# EAGLE design DCAmp (EAGLE 5.11)
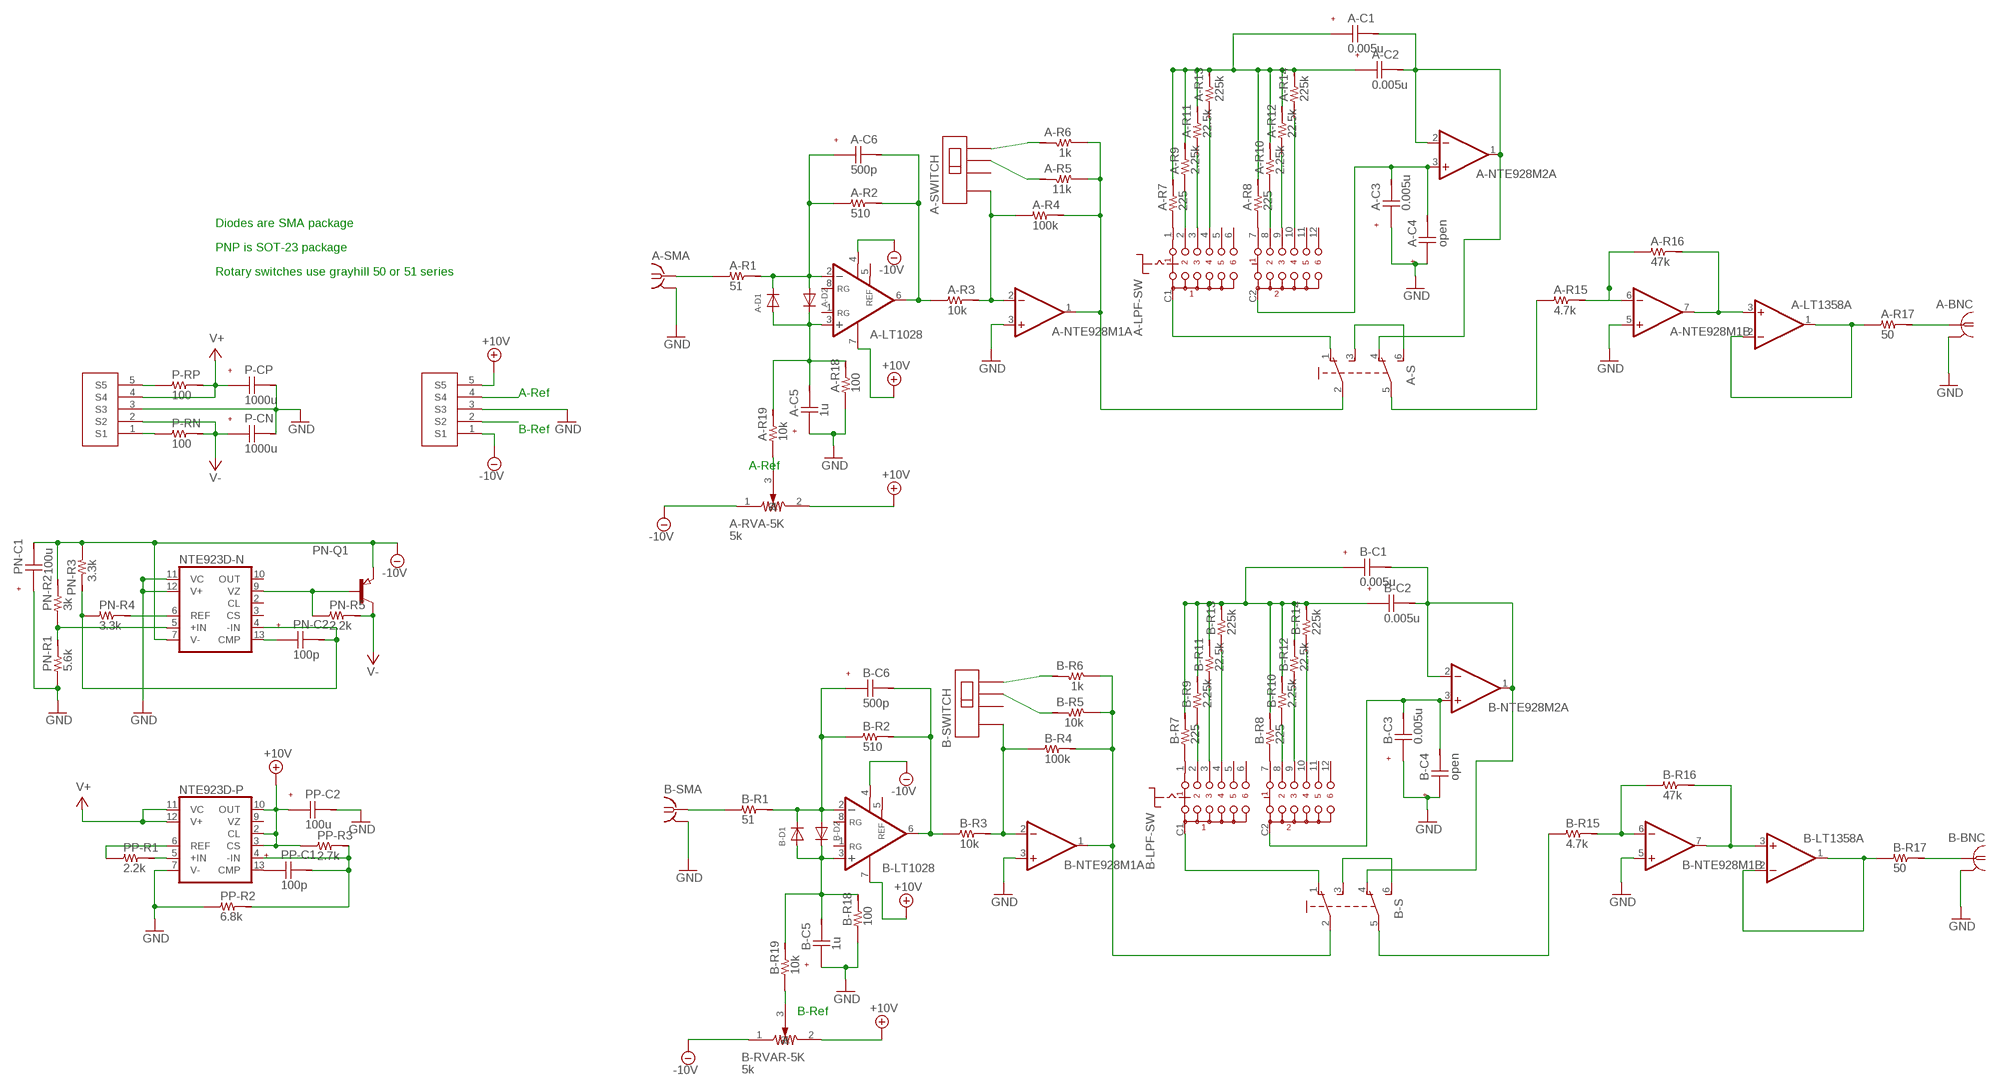
[diagram p0: schematic, sheet 1]

## Parts
A-BNC  1-227161-2  [AMP_227161]
A-C1  0.005u  CC0805  [0803]
A-C2  0.005u  CC0805  [0803]
A-C3  0.005u  CC0805  [0803]
A-C4  open  CC0805  [0803]
A-C5  1u  CC0805  [0803]
A-C6  500p  CC0805  [0803]
A-D1  DIODESMA  [SMADIODE]
A-D2  DIODESMA  [SMADIODE]
A-LPF-SW  50-2POLE30  [50-2POLE30]
A-LT1028  LT1168ACN8  [DIL08]
A-LT1358  LM358N  [DIL08]
A-NTE928M1  LM358N  [DIL08]
A-NTE928M2  LM358N  [DIL08]
A-R1  51  RR0805  [0803]
A-R2  510  RR0805  [0803]
A-R3  10k  RR0805  [0803]
A-R4  100k  RR0805  [0803]
A-R5  11k  RR0805  [0803]
A-R6  1k  RR0805  [0803]
A-R7  225  RR0805  [0803]
A-R8  225  RR0805  [0803]
A-R9  2.25k  RR0805  [0803]
A-R10  2.25k  RR0805  [0803]
A-R11  22.5k  RR0805  [0803]
A-R12  22.5k  RR0805  [0803]
A-R13  225k  RR0805  [0803]
A-R14  225k  RR0805  [0803]
A-R15  4.7k  RR0805  [0803]
A-R16  47k  RR0805  [0803]
A-R17  50  RR0805  [0803]
A-R18  100  RR0805  [0803]
A-R19  10k  RR0805  [0803]
A-RVA-5K  5k  POT3  [POTENTIOMETER3224]
A-S  TL46YO  [TL4XYO]
A-SMA  BU-SMA-G  [BU-SMA-G]
A-SWITCH  AYZ0103  [AYZ0103]
B-BNC  1-227161-2  [AMP_227161]
B-C1  0.005u  CC0805  [0803]
B-C2  0.005u  CC0805  [0803]
B-C3  0.005u  CC0805  [0803]
B-C4  open  CC0805  [0803]
B-C5  1u  CC0805  [0803]
B-C6  500p  CC0805  [0803]
B-D1  DIODESMA  [SMADIODE]
B-D2  DIODESMA  [SMADIODE]
B-LPF-SW  50-2POLE30  [50-2POLE30]
B-LT1028  LT1168ACN8  [DIL08]
B-LT1358  LM358N  [DIL08]
B-NTE928M1  LM358N  [DIL08]
B-NTE928M2  LM358N  [DIL08]
B-R1  51  RR0805  [0803]
B-R2  510  RR0805  [0803]
B-R3  10k  RR0805  [0803]
B-R4  100k  RR0805  [0803]
B-R5  10k  RR0805  [0803]
B-R6  1k  RR0805  [0803]
B-R7  225  RR0805  [0803]
B-R8  225  RR0805  [0803]
B-R9  2.25k  RR0805  [0803]
B-R10  2.25k  RR0805  [0803]
B-R11  22.5k  RR0805  [0803]
B-R12  22.5k  RR0805  [0803]
B-R13  225k  RR0805  [0803]
B-R14  225k  RR0805  [0803]
B-R15  4.7k  RR0805  [0803]
B-R16  47k  RR0805  [0803]
B-R17  50  RR0805  [0803]
B-R18  100  RR0805  [0803]
B-R19  10k  RR0805  [0803]
B-RVAR-5K  5k  POT3  [POTENTIOMETER3224]
B-S  TL46YO  [TL4XYO]
B-SMA  BU-SMA-G  [BU-SMA-G]
B-SWITCH  AYZ0103  [AYZ0103]
NTE923D-N  LM723N  [DIL14]
NTE923D-P  LM723N  [DIL14]
P-CN  1000u  CC0805  [0803]
P-CP  1000u  CC0805  [0803]
P-RN  100  RR0805  [0803]
P-RP  100  RR0805  [0803]
PN-C1  100u  CC0805  [0803]
PN-C2  100p  CC0805  [0803]
PN-Q1  PNP-TRANSISTOR_SOT23  [SOT23]
PN-R1  5.6k  RR0805  [0803]
PN-R2  3k  RR0805  [0803]
PN-R3  3.3k  RR0805  [0803]
PN-R4  3.3k  RR0805  [0803]
PN-R5  2.2k  RR0805  [0803]
POWER  SH05MOLEX  [SP5]
PP-C1  100p  CC0805  [0803]
PP-C2  100u  CC0805  [0803]
PP-R1  2.2k  RR0805  [0803]
PP-R2  6.8k  RR0805  [0803]
PP-R3  2.7k  RR0805  [0803]
REF-RES  SH05MOLEX  [SP5]

## Nets
+10V: A-LT1028.7(V+) A-RVA-5K.2 B-LT1028.7(V+) B-RVAR-5K.2 NTE923D-P.2(CL) NTE923D-P.3(CS) NTE923D-P.10(OUT) PP-C2.1 PP-R3.1 REF-RES.5(S5)
-10V: A-LT1028.4(V-) A-RVA-5K.1 B-LT1028.4(V-) B-RVAR-5K.1 NTE923D-N.7(V-) PN-C1.2 PN-Q1.2(E) PN-R2.2 PN-R3.1 REF-RES.1(S1)
A-REF: A-R19.1 A-RVA-5K.3 REF-RES.4(S4)
B-REF: B-R19.1 B-RVAR-5K.3 REF-RES.2(S2)
GND: A-BNC.2(GND) A-C3.1 A-C4.1 A-C5.1 A-NTE928M1.3(A:+IN) A-NTE928M1.5(B:+IN) A-R18.1 A-SMA.2(GND) B-BNC.2(GND) B-C3.1 B-C4.1 B-C5.1 B-NTE928M1.3(A:+IN) B-NTE928M1.5(B:+IN) B-R18.1 B-SMA.2(GND) NTE923D-N.11(VC) NTE923D-N.12(V+) NTE923D-P.7(V-) P-CN.2 P-CP.2 PN-C1.1 PN-R1.1 POWER.3(S3) PP-C2.2 PP-R2.1 REF-RES.3(S3)
N$1: B-R1.1 B-SMA.1
N$2: A-C6.2 A-LT1028.6(OUT) A-R2.2 A-R3.1
N$3: A-NTE928M1.2(A:-IN) A-R3.2 A-R4.1 A-SWITCH.4
N$4: A-C1.2 A-C2.2 A-NTE928M2.1(A:OUT) A-NTE928M2.2(A:-IN) A-S.4(O1)
N$5: B-C6.1 B-D1.C B-D2.A B-LT1028.2(-IN) B-R1.2 B-R2.1
N$6: NTE923D-P.13(CMP) PP-C1.1
N$7: A-NTE928M1.6(B:-IN) A-R15.2 A-R16.1
N$8: A-LT1358.3(A:+IN) A-NTE928M1.7(B:OUT) A-R16.2
N$9: A-C1.1 A-C2.1 A-R7.2 A-R8.2 A-R9.2 A-R10.2 A-R11.2 A-R12.2 A-R13.2 A-R14.2
N$10: A-LPF-SW.1 A-R7.1
N$11: A-R15.1 A-S.5(P1)
N$12: A-LT1358.1(A:OUT) A-LT1358.2(A:-IN) A-R17.1
N$13: NTE923D-P.4(-IN) PP-C1.2 PP-R2.2 PP-R3.2
N$14: A-BNC.1 A-R17.2
N$15: B-C5.2 B-D1.A B-D2.C B-LT1028.3(+IN) B-R18.2 B-R19.2
N$16: A-R5.2 A-SWITCH.2
N$17: NTE923D-N.5(+IN) PN-R1.2 PN-R2.1
N$18: B-R5.2 B-SWITCH.2
N$19: A-C5.2 A-D1.A A-D2.C A-LT1028.3(+IN) A-R18.2 A-R19.2
N$20: NTE923D-P.5(+IN) PP-R1.2
N$21: NTE923D-P.6(REF) PP-R1.1
N$22: A-C3.2 A-C4.2 A-LPF-SW.C2(S2) A-NTE928M2.3(A:+IN)
N$23: NTE923D-N.13(CMP) PN-C2.1
N$24: NTE923D-N.4(-IN) PN-C2.2 PN-R3.2 PN-R4.1
N$25: NTE923D-N.9(VZ) PN-Q1.1(B) PN-R5.1
N$26: A-LPF-SW.C1(S1) A-S.1(O)
N$27: A-S.3(S) A-S.6(S1)
N$28: A-R6.2 A-SWITCH.1
N$29: NTE923D-N.6(REF) PN-R4.2
N$30: B-C6.2 B-LT1028.6(OUT) B-R2.2 B-R3.1
N$31: B-NTE928M1.2(A:-IN) B-R3.2 B-R4.1 B-SWITCH.4
N$32: A-NTE928M1.1(A:OUT) A-R4.2 A-R5.1 A-R6.1 A-S.2(P)
N$33: A-LPF-SW.2 A-R9.1
N$34: A-LPF-SW.3 A-R11.1
N$35: A-LPF-SW.4 A-R13.1
N$36: A-LPF-SW.7 A-R8.1
N$37: A-LPF-SW.8 A-R10.1
N$38: A-LPF-SW.9 A-R12.1
N$39: A-LPF-SW.10 A-R14.1
N$40: B-C1.1 B-C2.1 B-R7.2 B-R8.2 B-R9.2 B-R10.2 B-R11.2 B-R12.2 B-R13.2 B-R14.2
N$41: B-R15.1 B-S.5(P1)
N$42: B-NTE928M1.6(B:-IN) B-R15.2 B-R16.1
N$43: B-LT1358.3(A:+IN) B-NTE928M1.7(B:OUT) B-R16.2
N$44: B-LT1358.1(A:OUT) B-LT1358.2(A:-IN) B-R17.1
N$45: B-BNC.1 B-R17.2
N$47: B-LPF-SW.C1(S1) B-S.1(O)
N$48: B-S.3(S) B-S.6(S1)
N$49: P-RP.1 POWER.5(S5)
N$50: B-NTE928M1.1(A:OUT) B-R4.2 B-R5.1 B-R6.1 B-S.2(P)
N$51: B-C1.2 B-C2.2 B-NTE928M2.1(A:OUT) B-NTE928M2.2(A:-IN) B-S.4(O1)
N$52: B-LPF-SW.1 B-R7.1
N$53: B-LPF-SW.2 B-R9.1
N$54: B-LPF-SW.3 B-R11.1
N$55: B-LPF-SW.4 B-R13.1
N$56: B-LPF-SW.7 B-R8.1
N$57: B-LPF-SW.8 B-R10.1
N$58: B-LPF-SW.9 B-R12.1
N$59: B-LPF-SW.10 B-R14.1
N$60: B-R6.2 B-SWITCH.1
N$61: P-RN.1 POWER.1(S1)
N$62: B-C3.2 B-C4.2 B-LPF-SW.C2(S2) B-NTE928M2.3(A:+IN)
N$63: A-R1.1 A-SMA.1
SMA: A-C6.1 A-D1.C A-D2.A A-LT1028.2(-IN) A-R1.2 A-R2.1
V+: NTE923D-P.11(VC) NTE923D-P.12(V+) P-CP.1 P-RP.2 POWER.4(S4)
V-: P-CN.1 P-RN.2 PN-Q1.3(C) PN-R5.2 POWER.2(S2)
Unconnected: A-LPF-SW.5 A-LPF-SW.6 A-LPF-SW.11 A-LPF-SW.12 A-LT1028.1(RG) A-LT1028.5(REF) A-LT1028.8(RG) A-LT1358.5(B:+IN) A-LT1358.6(B:-IN) A-LT1358.7(B:OUT) A-NTE928M2.5(B:+IN) A-NTE928M2.6(B:-IN) A-NTE928M2.7(B:OUT) A-SWITCH.3 B-LPF-SW.5 B-LPF-SW.6 B-LPF-SW.11 B-LPF-SW.12 B-LT1028.1(RG) B-LT1028.5(REF) B-LT1028.8(RG) B-LT1358.5(B:+IN) B-LT1358.6(B:-IN) B-LT1358.7(B:OUT) B-NTE928M2.5(B:+IN) B-NTE928M2.6(B:-IN) B-NTE928M2.7(B:OUT) B-SWITCH.3 NTE923D-N.2(CL) NTE923D-N.3(CS) NTE923D-N.10(OUT) NTE923D-P.9(VZ)

## Notes on the sheet
- Diodes are SMA package
- PNP is SOT-23 package
- Rotary switches use grayhill 50 or 51 series
- A-Ref
- B-Ref
- A-Ref
- B-Ref

## Power pins joined to a net without a drawn wire
GND: A-SMA.3(GND) A-SMA.4(GND) A-SMA.5(GND) B-SMA.3(GND) B-SMA.4(GND) B-SMA.5(GND)
V+: A-LT1358.8(P:V+) A-NTE928M1.8(P:V+) A-NTE928M2.8(P:V+) B-LT1358.8(P:V+) B-NTE928M1.8(P:V+) B-NTE928M2.8(P:V+)
V-: A-LT1358.4(P:V-) A-NTE928M1.4(P:V-) A-NTE928M2.4(P:V-) B-LT1358.4(P:V-) B-NTE928M1.4(P:V-) B-NTE928M2.4(P:V-)

## Library data of the parts
A-BNC B-BNC = con-coax:?227161*: JACK, RIGHT ANGLE, 50 OHM, PCB, BNC Source: amp_227161.pdf; OC_FARNELL: unknown; OC_NEWARK: unknown
A-C1-A-C6 B-C1-B-C6 P-CN P-CP PN-C1 PN-C2 PP-C1 PP-C2 = 0jcdoll:C
A-D1 A-D2 B-D1 B-D2 = adafruit:DIODE: Diode SMADIODE - SMA Surface Mount Package 20V 1A Schottky Diode Digikey: 641-1014-6-ND DO-1N4148 - Through Hole Small Current Diode SOD-123 20V 1 A (.5mV Vf) Schottky Diode - Digikey: MBRX120TPMSCT-ND SOD-323 10V 570mA (.38mV Vf, 3ns) Schottky Diode - Digikey: ZLLS410CT-ND SOD-523 30V 30mA Schottky Diode (RB751S-40TE61) - Digikey: RB751S-40TE61CT-ND SOT23-R/W - SOT23 Package (R = Solder Paste/Reflow Ovens, W = Hand-Soldering) BAT54Film 40V 300mA - Digikey: 497-7162-1-ND
A-LPF-SW B-LPF-SW = switch:50-2POLE30: SERIES 50 Single-Deck Rotary Switches two pole 30° Source: www.grayhill.com .. J-15-21.pdf
A-LT1028 B-LT1028 = linear-technology:LT1168: Low Power, Single Resistor Gain Programmable, Precision Instrumentation Amplifier SourcE: LT1168.pdf; OC_FARNELL: unknown; OC_NEWARK: unknown
A-LT1358 A-NTE928M1 A-NTE928M2 B-LT1358 B-NTE928M1 B-NTE928M2 = linear:LM358: OP AMP also LM158; LM258; LM2904 Source: http://cache.national.com/ds/LM/LM158.pdf
A-R1-A-R19 B-R1-B-R19 P-RN P-RP PN-R1-PN-R5 PP-R1-PP-R3 = 0jcdoll:R
A-RVA-5K B-RVAR-5K = 0jcdoll:POT3
A-S B-S = switch:TL46YO: TINY SWITCH ON - ON Source: http://www2.produktinfo.conrad.com/datenblaetter/700000-724999/705152-da-01-de-Subminiaturschalter_TL_36YO.pdf
A-SMA B-SMA = con-coax:BU-SMA-G: FEMALE SMA CONNECTOR Radiall distributor RS 193-9117; OC_FARNELL: unknown; OC_NEWARK: unknown
A-SWITCH B-SWITCH = 0jcdoll:AYZ0103
NTE923D-N NTE923D-P = linear:*723: Positive VOLTAGE REGULATOR
PN-Q1 = semicon-smd-ipc:PNP-TRANSISTOR_: PNP TRANSISTOR
POWER REF-RES = 0jcdoll:SH05

## Board
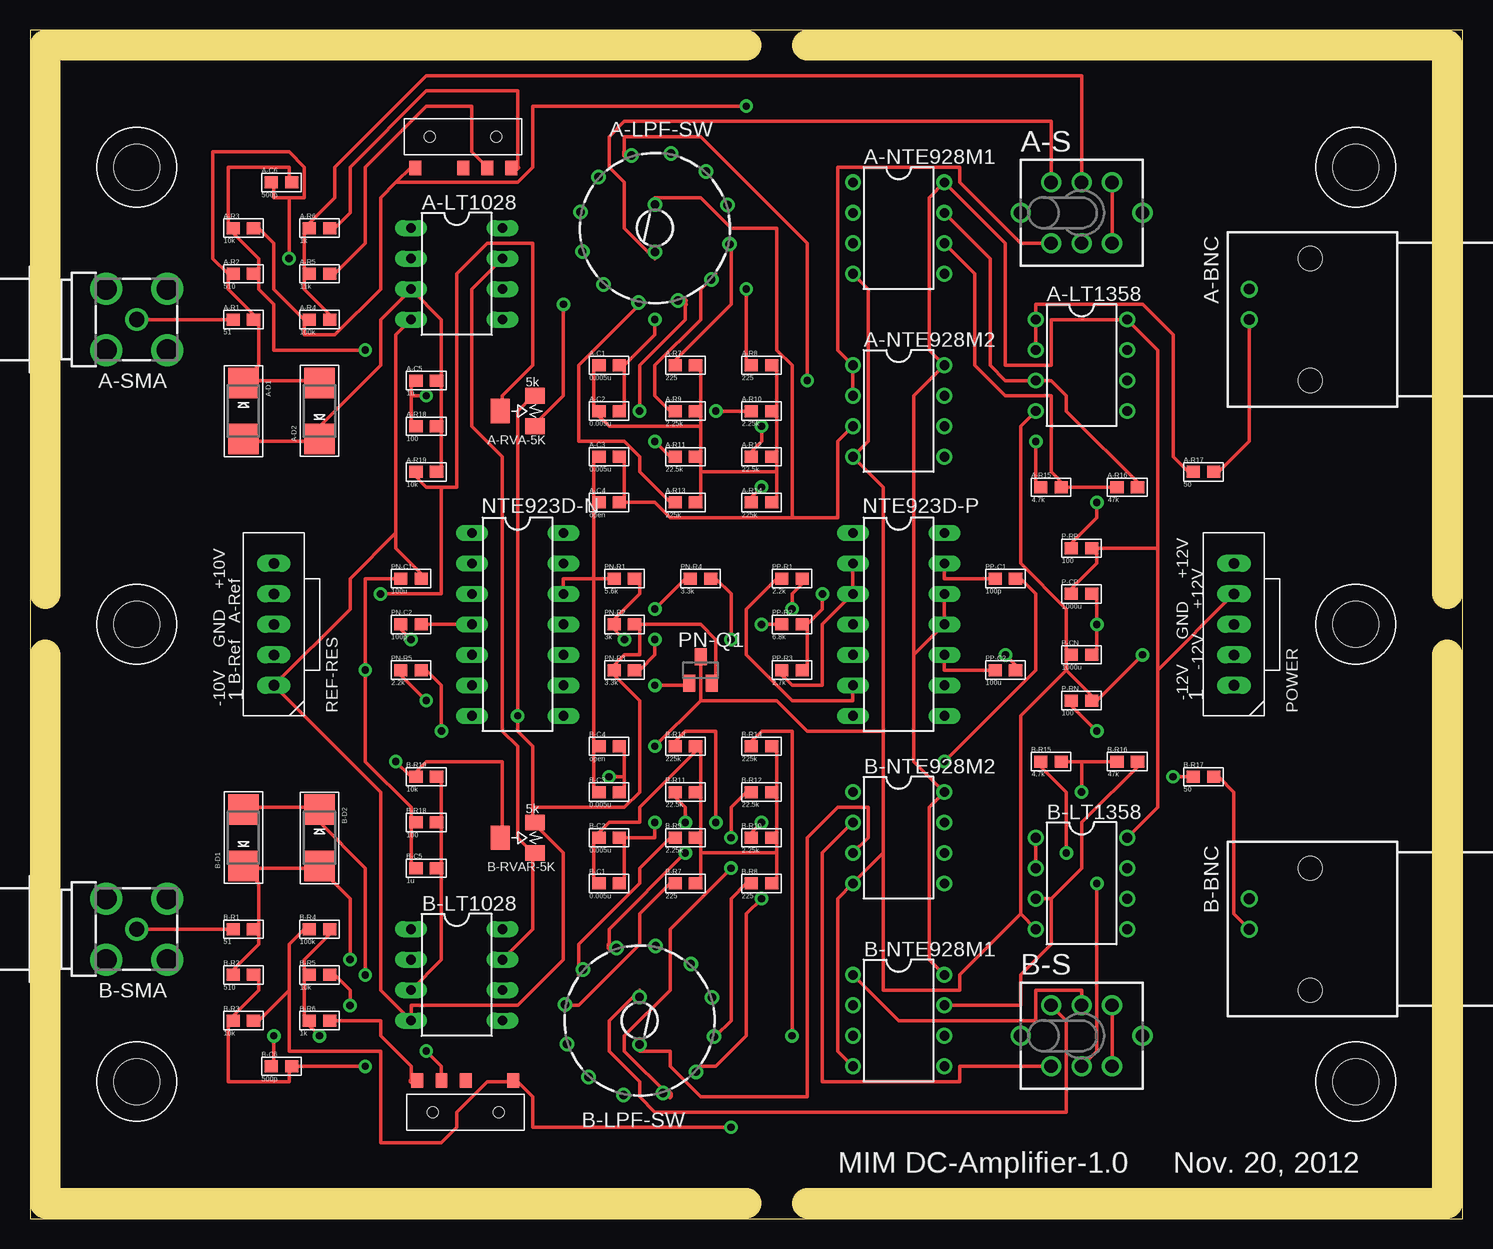
[diagram p1: board, top side]
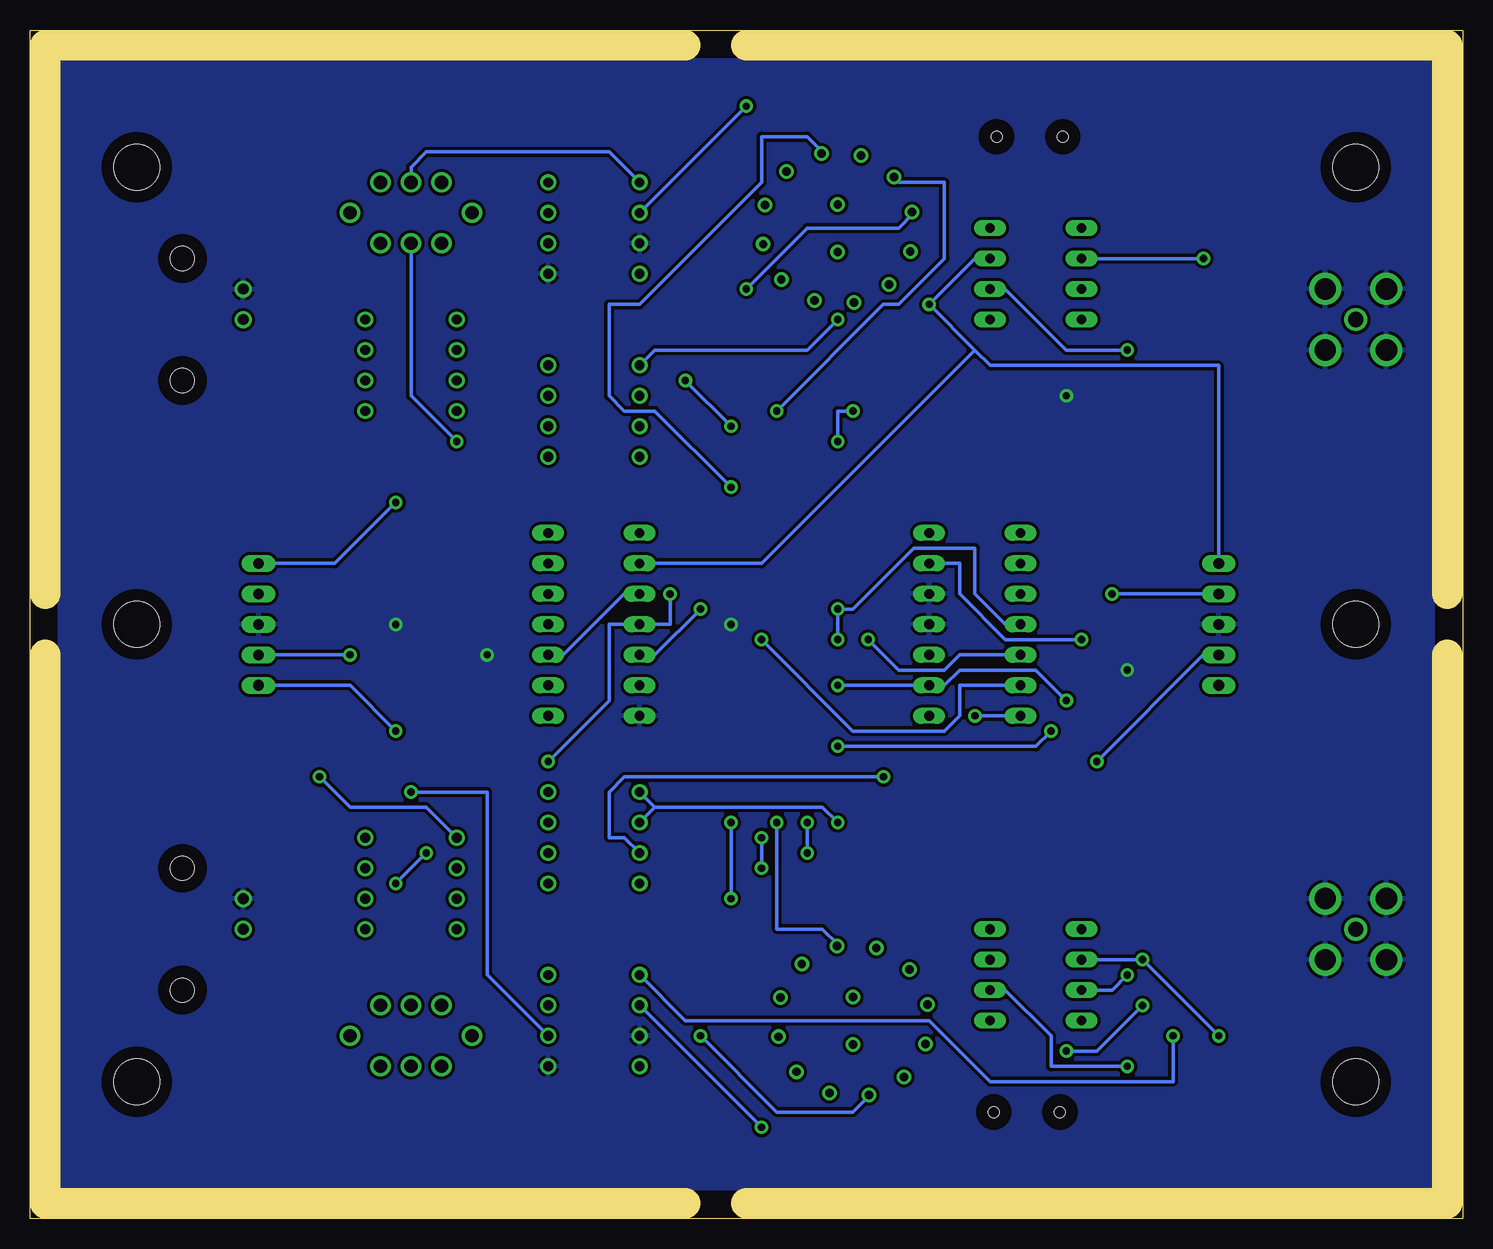
[diagram p2: board, bottom side, seen from below]

Size 119.38 x 99.06 mm. Coordinates in mm from the lower left corner, seen from the top.
Outline: 0,0 119.38,0 119.38,99.06 0,99.06 0,0
Copper layers (1*16): Top 0.035mm / dielectric 1.5mm / Bottom 0.035mm
Design rules "Sierra": minimum track width 12mil, minimum drill 24mil, track to track 10mil, track to pad 10mil, pad to pad 10mil, via to via 10mil, smd to smd 10mil, copper to edge 40mil, drill to drill 10mil, minimum pad ring 10mil, minimum via ring 10mil, stop-mask expansion 4mil, vias tented up to drill 0mil, thermal gap 10mil
Milling: 8 lines

### Footprints (pad centres in the part's own frame; a part is rotated, then mirrored left to right if it is on the bottom)
AMP_227161 = drill 0.9 pad 1.27 round: 1 0,-5.08; 2 -2.54,-5.08 | hole 2: -5.08,0; 5.08,0
0803 = smd 1.1 x 1: 1 -0.85,0; 2 0.85,0
SMADIODE = smd 2.54 x 2.54: A 2.349,0; C -2.349,0
50-2POLE30 = drill 0.7 pad 1.2 round: 1 6.207,-1.342; 2 4.704,-4.265; 3 1.941,-6.046; 4 -1.342,-6.207; 5 -4.265,-4.704; 6 -6.046,-1.941; 7 -6.207,1.342; 8 -4.704,4.265; 9 -1.941,6.046; 10 1.342,6.207; 11 4.265,4.704; 12 6.046,1.941; C1 0,-1.98; C2 0,1.98
DIL08 = drill 0.813 long: 1 -3.81,-3.81; 2 -1.27,-3.81; 3 1.27,-3.81; 4 3.81,-3.81; 5 3.81,3.81; 6 1.27,3.81; 7 -1.27,3.81; 8 -3.81,3.81
DIL08' = drill 0.813 pad 1.27 round: 1 -3.81,-3.81; 2 -1.27,-3.81; 3 1.27,-3.81; 4 3.81,-3.81; 5 3.81,3.81; 6 1.27,3.81; 7 -1.27,3.81; 8 -3.81,3.81
POTENTIOMETER3224 = smd 1.6 x 1.295: 1 1.448,1.27; 2 1.448,-1.27 | smd 1.6 x 2.007: 3 -1.448,0
TL4XYO = drill 1.1 pad 1.676 round: 1 -2.54,2.54; 2 0,2.54; 3 2.54,2.54; 4 -2.54,-2.54; 5 0,-2.54; 6 2.54,-2.54; M1 -5.08,0; M2 5.08,0
BU-SMA-G = drill 1.27 round: 1 0,0 | drill 1.778 round: 2 -2.55,2.55; 3 2.55,2.55; 4 2.55,-2.55; 5 -2.55,-2.55
AYZ0103 = smd 0.991 x 1.194: 1 -2.007,2.616; 2 0,2.616; 3 2.007,2.616; 4 5.994,2.616 | hole 0.9: -0.737,0; 4.775,0
DIL14 = drill 0.813 long: 1 -7.62,-3.81; 2 -5.08,-3.81; 3 -2.54,-3.81; 4 0,-3.81; 5 2.54,-3.81; 6 5.08,-3.81; 7 7.62,-3.81; 8 7.62,3.81; 9 5.08,3.81; 10 2.54,3.81; 11 0,3.81; 12 -2.54,3.81; 13 -5.08,3.81; 14 -7.62,3.81
SOT23 = smd 1 x 1.4: 1 -0.95,-1.1; 2 0.95,-1.1; 3 0,1.1
SP5 = drill 0.889 long: 1 -5.08,0; 2 -2.54,0; 3 0,0; 4 2.54,0; 5 5.08,0
632SCREW = hole 3.81: 0,0

### Placement (x,y rotation side)
A-BNC  106.68,74.93 270 top
A-C1  48.26,71.12 0 top
A-C2  48.26,67.31 0 top
A-C3  48.26,63.5 0 top
A-C4  48.26,59.69 0 top
A-C5  33.02,69.85 0 top
A-C6  20.95,86.36 0 top
A-D1  17.78,67.31 270 top
A-D2  24.13,67.31 90 top
A-LPF-SW  52.07,82.55 0 top
A-LT1028  35.56,78.74 270 top
A-LT1358  [DIL08']  87.63,71.12 270 top
A-NTE928M1  [DIL08']  72.39,82.55 270 top
A-NTE928M2  [DIL08']  72.39,67.31 270 top
A-R1  17.78,74.93 0 top
A-R2  17.78,78.74 0 top
A-R3  17.78,82.55 0 top
A-R4  24.13,74.93 0 top
A-R5  24.13,78.74 0 top
A-R6  24.13,82.55 0 top
A-R7  54.61,71.12 0 top
A-R8  60.96,71.12 0 top
A-R9  54.61,67.31 0 top
A-R10  60.96,67.31 0 top
A-R11  54.61,63.5 0 top
A-R12  60.96,63.5 0 top
A-R13  54.61,59.69 0 top
A-R14  60.96,59.69 0 top
A-R15  85.09,60.96 0 top
A-R16  91.44,60.96 0 top
A-R17  97.79,62.23 0 top
A-R18  33.02,66.04 0 top
A-R19  33.02,62.23 0 top
A-RVA-5K  40.64,67.31 0 top
A-S  87.63,83.82 0 top
A-SMA  8.89,74.93 180 top
A-SWITCH  38.1,90.17 180 top
B-BNC  106.68,24.13 270 top
B-C1  48.26,27.94 0 top
B-C2  48.26,31.75 0 top
B-C3  48.26,35.56 0 top
B-C4  48.26,39.37 0 top
B-C5  33.02,29.21 0 top
B-C6  20.95,12.7 0 top
B-D1  17.78,31.75 90 top
B-D2  24.13,31.75 270 top
B-LPF-SW  50.8,16.51 180 top
B-LT1028  35.56,20.32 270 top
B-LT1358  [DIL08']  87.63,27.94 270 top
B-NTE928M1  [DIL08']  72.39,16.51 270 top
B-NTE928M2  [DIL08']  72.39,31.75 270 top
B-R1  17.78,24.13 0 top
B-R2  17.78,20.32 0 top
B-R3  17.78,16.51 0 top
B-R4  24.13,24.13 0 top
B-R5  24.13,20.32 0 top
B-R6  24.13,16.51 0 top
B-R7  54.61,27.94 0 top
B-R8  60.96,27.94 0 top
B-R9  54.61,31.75 0 top
B-R10  60.96,31.75 0 top
B-R11  54.61,35.56 0 top
B-R12  60.96,35.56 0 top
B-R13  54.61,39.37 0 top
B-R14  60.96,39.37 0 top
B-R15  85.09,38.1 0 top
B-R16  91.44,38.1 0 top
B-R17  97.79,36.83 0 top
B-R18  33.02,33.02 0 top
B-R19  33.02,36.83 0 top
B-RVAR-5K  40.64,31.75 0 top
B-S  87.63,15.24 0 top
B-SMA  8.89,24.13 180 top
B-SWITCH  34.29,8.89 0 top
NTE923D-N  40.64,49.53 270 top
NTE923D-P  72.39,49.53 270 top
P-CN  87.63,46.99 0 top
P-CP  87.63,52.07 0 top
P-RN  87.63,43.18 0 top
P-RP  87.63,55.88 0 top
PN-C1  31.75,53.34 0 top
PN-C2  31.75,49.53 0 top
PN-Q1  55.88,45.72 0 top
PN-R1  49.53,53.34 0 top
PN-R2  49.53,49.53 0 top
PN-R3  49.53,45.72 0 top
PN-R4  55.88,53.34 0 top
PN-R5  31.75,45.72 0 top
POWER  100.33,49.53 90 top
PP-C1  81.28,53.34 0 top
PP-C2  81.28,45.72 0 top
PP-R1  63.5,53.34 0 top
PP-R2  63.5,49.53 0 top
PP-R3  63.5,45.72 0 top
REF-RES  20.32,49.53 90 top
U$1  [632SCREW]  110.49,49.53 0 top
U$2  [632SCREW]  8.89,49.53 0 top
U$3  [632SCREW]  110.49,87.63 0 top
U$4  [632SCREW]  110.49,11.43 0 top
U$5  [632SCREW]  8.89,11.43 0 top
U$6  [632SCREW]  8.89,87.63 0 top

### Tracks (layer width: path | path; a pad name or v marks a point on that pad's centre or on a via)
+10V  (via drill 0.61)
  Top 0.305: NTE923D-P.10 76.2,45.72 PP-C2.1 | PP-R3.1 62.23,45.72 63.5,44.45 66.04,44.45 66.04,49.53 NTE923D-P.3 NTE923D-P.2 | 41.91,30.48 41.91,24.13 B-LT1028.7 | v44.45,76.2 44.45,68.58 41.91,66.04 A-RVA-5K.2 | 41.91,30.48 40.64,31.75 40.64,39.37 39.37,40.64 39.37,63.5 36.83,66.04 36.83,77.47 A-LT1028.7 | 41.91,30.48 B-RVAR-5K.2
  Bottom 0.305: NTE923D-P.10 74.93,46.99 69.85,52.07 NTE923D-P.3 | A-LT1028.7 40.64,80.01 v44.45,76.2 40.64,72.39 | REF-RES.5 20.32,71.12 39.37,71.12 40.64,72.39 | NTE923D-P.2 58.42,54.61 40.64,72.39
-10V  (via drill 0.61)
  Top 0.305: 30.48,57.15 30.48,73.66 A-LT1028.4 | 30.48,57.15 30.48,55.88 33.02,53.34 PN-C1.2 | 30.48,57.15 26.67,53.34 26.67,50.8 REF-RES.1 29.21,35.56 29.21,19.05 B-LT1028.4 31.75,17.78 40.64,17.78 44.45,21.59 44.45,30.48 41.91,33.02 | 48.26,45.72 49.53,46.99 50.8,46.99 50.8,49.53 | 50.8,49.53 55.88,49.53 57.15,48.26 57.15,44.45 PN-Q1.2 | 50.8,49.53 PN-R2.2 | 41.91,33.02 41.91,34.29 | 41.91,34.29 41.91,39.37 40.64,40.64 v40.64,41.91 40.64,67.31 41.91,68.58 A-RVA-5K.1 | 41.91,33.02 B-RVAR-5K.1 | 48.26,45.72 50.8,43.18 50.8,35.56 49.53,34.29 41.91,34.29 | 48.26,45.72 PN-R3.1
  Bottom 0.305: v40.64,41.91 NTE923D-N.7
A-REF  (via drill 0.61)
  Top 0.305: 34.29,60.96 35.56,60.96 35.56,78.74 38.1,81.28 41.91,81.28 41.91,71.12 39.37,68.58 39.37,67.31 A-RVA-5K.3 | 34.29,60.96 33.02,60.96 31.75,62.23 A-R19.1 | v29.21,52.07 34.29,52.07 34.29,60.96
  Bottom 0.305: REF-RES.4 v29.21,52.07
B-REF  (via drill 0.61)
  Top 0.305: 31.75,36.83 33.02,38.1 39.37,38.1 39.37,31.75 B-RVAR-5K.3 | v30.48,38.1 31.75,36.83 | 31.75,36.83 B-R19.1
  Bottom 0.305: REF-RES.2 21.59,46.99 v30.48,38.1
GND  (via drill 0.61)
  Top 0.305: 31.75,33.02 31.75,29.21 B-C5.1 | 31.75,33.02 31.75,34.29 27.94,38.1 v27.94,45.72 27.94,53.34 PN-C1.1 | 31.75,33.02 B-R18.1 | P-CN.2 88.9,46.99 v88.9,49.53 88.9,52.07 P-CP.2 | 46.99,59.69 46.99,63.5 A-C3.1 | 46.99,39.37 46.99,35.56 B-C3.1 | 31.75,68.58 31.75,69.85 A-C5.1 | 31.75,68.58 31.75,66.04 A-R18.1 | PP-R2.1 v60.96,49.53 | v81.28,46.99 82.55,45.72 PP-C2.2 | 46.99,53.34 44.45,53.34 NTE923D-N.12 | 46.99,53.34 PN-R1.1 | 31.75,68.58 v33.02,68.58 | 46.99,39.37 46.99,53.34 | 46.99,39.37 B-C4.1 | 46.99,53.34 46.99,59.69 | 46.99,59.69 A-C4.1
  pour Bottom: 2.54,2.54 116.84,2.54 116.84,96.52 2.54,96.52
N$1
  Top 0.305: B-SMA.1 B-R1.1
N$2  (via drill 0.61)
  Top 0.305: 16.51,82.55 19.05,80.01 19.05,78.74 | 16.51,82.55 16.51,87.63 21.59,87.63 21.59,86.36 A-C6.2 | 16.51,82.55 A-R3.1 | v27.94,72.39 20.32,72.39 20.32,76.2 19.05,77.47 19.05,78.74 | 19.05,78.74 A-R2.2
  Bottom 0.305: A-LT1028.6 38.1,77.47 33.02,72.39 v27.94,72.39
N$3  (via drill 0.61)
  Top 0.305: 22.86,74.93 20.32,77.47 20.32,81.28 19.05,82.55 A-R3.2 | 30.48,86.36 29.21,85.09 29.21,77.47 25.4,73.66 22.86,73.66 22.86,74.93 | 30.48,86.36 31.75,87.63 A-SWITCH.4 | A-R4.1 22.86,74.93 | v59.69,92.71 41.91,92.71 41.91,87.63 40.64,86.36 30.48,86.36
  Bottom 0.305: v59.69,92.71 A-NTE928M1.2
N$4  (via drill 0.61)
  Top 0.305: 49.53,71.12 49.53,67.31 A-C2.2 | 49.53,71.12 52.07,73.66 v52.07,74.93 | 49.53,71.12 A-C1.2 | A-NTE928M2.2 A-NTE928M2.1 67.31,72.39 67.31,87.63 77.47,87.63 77.47,86.36 82.55,81.28 A-S.4
  Bottom 0.305: v52.07,74.93 54.61,72.39 67.31,72.39 A-NTE928M2.1
N$5  (via drill 0.61)
  Top 0.305: 19.05,24.13 19.05,22.86 16.51,20.32 B-R2.1 | 17.78,29.21 19.05,27.94 19.05,24.13 | 19.05,24.13 B-R1.2 | 24.13,29.21 17.78,29.21 | 17.78,29.21 B-D1.C | v20.32,15.24 20.32,12.7 B-C6.1 | 24.13,29.21 26.67,26.67 v26.67,21.59 | 24.13,29.21 B-D2.A
  Bottom 0.305: v20.32,15.24 v26.67,21.59 B-LT1028.2
N$6
  Top 0.305: NTE923D-P.13 76.2,53.34 PP-C1.1
N$7
  Top 0.305: 86.36,60.96 A-R16.1 | A-NTE928M1.6 78.74,78.74 78.74,71.12 81.28,68.58 85.09,68.58 85.09,62.23 86.36,60.96 | A-R15.2 86.36,60.96
N$8
  Top 0.305: A-R16.2 92.71,60.96 86.36,67.31 86.36,68.58 85.09,69.85 A-LT1358.3 81.28,69.85 80.01,71.12 80.01,80.01 A-NTE928M1.7
N$9
  Top 0.305: 62.23,62.23 62.23,63.5 | 62.23,62.23 62.23,59.69 A-R14.2 | 62.23,67.31 62.23,71.12 A-R8.2 | 62.23,63.5 62.23,67.31 | 62.23,63.5 A-R12.2 | 62.23,67.31 A-R10.2 | 46.99,67.31 46.99,71.12 A-C1.1 | 55.88,62.23 55.88,63.5 | 55.88,62.23 55.88,59.69 A-R13.2 | 55.88,67.31 55.88,71.12 A-R7.2 | 55.88,66.04 55.88,67.31 | 55.88,63.5 55.88,66.04 | 55.88,63.5 A-R11.2 | 55.88,67.31 A-R9.2 | 46.99,67.31 48.26,66.04 55.88,66.04 | 46.99,67.31 A-C2.1 | 55.88,62.23 62.23,62.23
N$10
  Top 0.305: A-R7.1 53.34,71.12 58.42,76.2 58.42,81.28 A-LPF-SW.1
N$11  (via drill 0.61)
  Top 0.305: v83.82,64.77 83.82,60.96 A-R15.1
  Bottom 0.305: v83.82,64.77 87.63,68.58 A-S.5
N$12
  Top 0.305: A-R17.1 96.52,62.23 95.25,63.5 95.25,73.66 92.71,76.2 83.82,76.2 A-LT1358.1 A-LT1358.2
N$13  (via drill 0.61)
  Top 0.305: 64.77,49.53 64.77,45.72 PP-R3.2 | v76.2,38.1 83.82,45.72 83.82,52.07 82.55,53.34 PP-C1.2 | 64.77,49.53 66.04,50.8 v66.04,52.07 | 64.77,49.53 PP-R2.2
  Bottom 0.305: v76.2,38.1 71.12,43.18 71.12,49.53 NTE923D-P.4 66.04,49.53 v66.04,52.07
N$14
  Top 0.305: A-BNC.1 101.6,64.77 99.06,62.23 A-R17.2
N$15  (via drill 0.61)
  Top 0.305: B-D1.A 17.78,34.29 24.13,34.29 B-D2.C 24.13,33.02 27.94,29.21 v27.94,20.32 | 34.29,29.21 34.29,33.02 | 34.29,33.02 34.29,36.83 B-R19.2 | 34.29,33.02 B-R18.2 | B-LT1028.3 34.29,21.59 34.29,29.21 | 34.29,29.21 B-C5.2
  Bottom 0.305: v27.94,20.32 29.21,19.05 B-LT1028.3
N$16
  Top 0.305: A-R5.2 25.4,78.74 27.94,81.28 27.94,87.63 33.02,92.71 36.83,92.71 36.83,88.9 38.1,87.63 A-SWITCH.2
N$17  (via drill 0.61)
  Top 0.305: 48.26,49.53 50.8,52.07 50.8,53.34 PN-R1.2 | v49.53,48.26 48.26,49.53 | 48.26,49.53 PN-R2.1
  Bottom 0.305: NTE923D-N.5 41.91,46.99 43.18,45.72 46.99,45.72 v49.53,48.26
N$18  (via drill 0.61)
  Top 0.305: v26.67,17.78 26.67,19.05 25.4,20.32 B-R5.2 | v33.02,13.97 34.29,12.7 B-SWITCH.2 34.29,11.43
  Bottom 0.305: v26.67,17.78 30.48,13.97 v33.02,13.97
N$19
  Top 0.305: A-D1.A 17.78,64.77 24.13,64.77 A-D2.C 24.13,66.04 29.21,71.12 29.21,74.93 A-LT1028.3 34.29,74.93 34.29,69.85 | 34.29,66.04 34.29,62.23 A-R19.2 | 34.29,69.85 34.29,66.04 | 34.29,66.04 A-R18.2 | 34.29,69.85 A-C5.2
N$20  (via drill 0.61)
  Top 0.305: v63.5,50.8 63.5,52.07 64.77,53.34 PP-R1.2
  Bottom 0.305: v63.5,50.8 67.31,46.99 NTE923D-P.5
N$21
  Top 0.305: NTE923D-P.6 68.58,43.18 63.5,43.18 59.69,46.99 59.69,50.8 62.23,53.34 PP-R1.1
N$22
  Top 0.305: 49.53,59.69 49.53,63.5 A-C3.2 | 49.53,59.69 52.07,59.69 53.34,58.42 63.5,58.42 | 63.5,58.42 67.31,58.42 67.31,64.77 A-NTE928M2.3 | A-C4.2 49.53,59.69 | 63.5,58.42 63.5,71.12 62.23,72.39 62.23,82.55 58.42,82.55 55.88,85.09 52.07,85.09 A-LPF-SW.C2
N$23  (via drill 0.61)
  Top 0.305: v31.75,48.26 30.48,49.53 PN-C2.1
  Bottom 0.305: v31.75,48.26 38.1,48.26 41.91,52.07 41.91,54.61 NTE923D-N.13
N$24  (via drill 0.61)
  Top 0.305: PN-C2.2 NTE923D-N.4 | v52.07,48.26 52.07,46.99 50.8,45.72 PN-R3.2 | v52.07,50.8 54.61,53.34 PN-R4.1
  Bottom 0.305: v52.07,48.26 v52.07,50.8 50.8,50.8 45.72,55.88 40.64,55.88 40.64,52.07 38.1,49.53 NTE923D-N.4
N$25  (via drill 0.61)
  Top 0.305: v33.02,43.18 30.48,45.72 PN-R5.1 | v52.07,44.45 54.61,44.45 PN-Q1.1
  Bottom 0.305: v33.02,43.18 35.56,45.72 41.91,45.72 43.18,44.45 NTE923D-N.9 v52.07,44.45
N$26
  Top 0.305: A-S.1 85.09,91.44 49.53,91.44 48.26,90.17 48.26,87.63 49.53,86.36 49.53,82.55 52.07,80.01 A-LPF-SW.C1
N$27
  Top 0.305: A-S.6 A-S.3
N$28
  Top 0.305: 40.64,87.63 40.64,93.98 33.02,93.98 26.67,87.63 26.67,83.82 25.4,82.55 A-R6.2
  Top 0.406: A-SWITCH.1 40.64,87.55 40.64,87.63
N$29  (via drill 0.61)
  Top 0.305: v58.42,48.26 58.42,52.07 57.15,53.34 PN-R4.2
  Bottom 0.305: v58.42,48.26 50.8,40.64 43.18,40.64 41.91,41.91 41.91,44.45 NTE923D-N.6
N$30  (via drill 0.61)
  Top 0.305: 16.51,16.51 19.05,19.05 19.05,20.32 B-R2.2 | 16.51,16.51 16.51,11.43 21.59,11.43 21.59,12.7 B-C6.2 v27.94,12.7 | 16.51,16.51 B-R3.1
  Bottom 0.305: B-LT1028.6 38.1,19.05 34.29,15.24 34.29,12.7 v27.94,12.7
N$31  (via drill 0.61)
  Top 0.305: 21.59,19.05 19.05,16.51 B-R3.2 | 21.59,19.05 21.59,22.86 22.86,24.13 B-R4.1 | 40.64,11.43 38.1,11.43 35.56,8.89 35.56,7.62 34.29,6.35 29.21,6.35 29.21,13.97 21.59,13.97 21.59,19.05 | v58.42,7.62 41.91,7.62 41.91,10.16 40.64,11.43 | 40.64,11.43 B-SWITCH.4
  Bottom 0.305: v58.42,7.62 B-NTE928M1.2
N$32
  Top 0.305: 22.86,78.74 22.86,82.55 | 22.86,78.74 22.86,77.47 25.4,74.93 A-R4.2 | 22.86,78.74 A-R5.1 | 22.86,82.55 25.4,85.09 25.4,87.63 33.02,95.25 87.63,95.25 A-S.2 | 22.86,82.55 A-R6.1
  Bottom 0.305: A-NTE928M1.1 71.12,88.9 86.36,88.9 87.63,87.63 A-S.2
N$33
  Top 0.305: A-R9.1 53.34,67.31 52.07,68.58 52.07,71.12 55.88,74.93 55.88,77.47 57.15,78.74 A-LPF-SW.2
N$34  (via drill 0.61)
  Top 0.305: v52.07,64.77 53.34,63.5 A-R11.1 | v50.8,67.31 50.8,71.12 54.61,74.93 54.61,76.2
  Top 0.406: A-LPF-SW.3 54.61,76.5 54.61,76.2
  Bottom 0.305: v52.07,64.77 52.07,67.31 v50.8,67.31
N$35
  Top 0.305: A-R13.1 53.34,59.69 50.8,62.23 50.8,63.5 49.53,64.77 45.72,64.77 45.72,71.12 50.8,76.2 A-LPF-SW.4
N$36  (via drill 0.61)
  Top 0.305: v59.69,77.47 59.69,71.12 A-R8.1
  Bottom 0.305: v59.69,77.47 54.61,82.55 46.99,82.55 45.72,83.82 A-LPF-SW.7
N$37  (via drill 0.61)
  Top 0.305: v57.15,67.31 A-R10.1
  Bottom 0.305: v57.15,67.31 48.26,76.2 46.99,76.2 43.18,80.01 43.18,86.36 46.99,86.36 A-LPF-SW.8
N$38  (via drill 0.61)
  Top 0.305: v60.96,66.04 60.96,64.77 59.69,63.5 A-R12.1 | v64.77,69.85 64.77,81.28 55.88,90.17 49.53,90.17 49.53,88.9
  Top 0.406: A-LPF-SW.9 49.53,88.6 49.53,88.9
  Bottom 0.305: v60.96,66.04 v64.77,69.85
N$39  (via drill 0.61)
  Top 0.305: v60.96,60.96 59.69,59.69 A-R14.1
  Bottom 0.305: v60.96,60.96 67.31,67.31 69.85,67.31 71.12,68.58 71.12,76.2 68.58,76.2 58.42,86.36 58.42,90.17 54.61,90.17 53.34,88.9 A-LPF-SW.10
N$40
  Top 0.305: 62.23,30.48 62.23,31.75 | 62.23,30.48 62.23,27.94 B-R8.2 | 62.23,35.56 62.23,39.37 B-R14.2 | 62.23,31.75 62.23,35.56 | 62.23,31.75 B-R10.2 | 62.23,35.56 B-R12.2 | 55.88,31.75 55.88,30.48 | 55.88,30.48 55.88,27.94 B-R7.2 | 46.99,31.75 46.99,27.94 B-C1.1 | 55.88,39.37 55.88,35.56 | 46.99,31.75 48.26,33.02 50.8,33.02 50.8,34.29 55.88,39.37 | 46.99,31.75 B-C2.1 | 55.88,39.37 B-R13.2 | 55.88,35.56 55.88,31.75 | 55.88,31.75 B-R9.2 | 55.88,35.56 B-R11.2 | 55.88,30.48 62.23,30.48
N$41  (via drill 0.61)
  Top 0.305: v86.36,30.48 86.36,35.56 83.82,38.1 B-R15.1 | v88.9,27.94 88.9,13.97 B-S.5
  Bottom 0.305: v88.9,27.94 v86.36,30.48
N$42  (via drill 0.61)
  Top 0.305: 87.63,38.1 B-R15.2 | 87.63,38.1 B-R16.1 | v87.63,35.56 87.63,38.1
  Bottom 0.305: B-NTE928M1.6 81.28,20.32 81.28,35.56 v87.63,35.56
N$43
  Top 0.305: 85.09,26.67 87.63,29.21 87.63,33.02 92.71,38.1 B-R16.2 | 85.09,26.67 B-LT1358.3 | B-NTE928M1.7 82.55,17.78 82.55,20.32 85.09,22.86 85.09,26.67
N$44  (via drill 0.61)
  Top 0.305: v95.25,36.83 B-R17.1 | B-LT1358.2 B-LT1358.1
  Bottom 0.305: v95.25,36.83 92.71,34.29 86.36,34.29 B-LT1358.1
N$45
  Top 0.305: B-BNC.1 100.33,25.4 100.33,35.56 99.06,36.83 B-R17.2
N$47
  Top 0.305: B-S.1 86.36,16.51 86.36,8.89 52.07,8.89 50.8,10.16 50.8,11.43 48.26,13.97 48.26,16.51 50.8,19.05 B-LPF-SW.C1
N$48
  Top 0.305: B-S.6 B-S.3
N$49  (via drill 0.61)
  Top 0.305: v88.9,59.69 88.9,58.42 86.36,55.88 P-RP.1
  Bottom 0.305: v88.9,59.69 93.98,54.61 POWER.5
N$50  (via drill 0.61)
  Top 0.305: 22.86,16.51 22.86,20.32 | 22.86,20.32 22.86,21.59 25.4,24.13 B-R4.2 | 22.86,20.32 B-R5.1 | B-NTE928M1.1 72.39,16.51 83.82,16.51 83.82,19.05 87.63,19.05 B-S.2 | v24.13,15.24 22.86,16.51 | 22.86,16.51 B-R6.1
  Bottom 0.305: v24.13,15.24 24.13,11.43 39.37,11.43 44.45,16.51 64.77,16.51 B-NTE928M1.1
N$51  (via drill 0.61)
  Top 0.305: 49.53,31.75 49.53,27.94 B-C1.2 | 49.53,31.75 52.07,31.75 v52.07,33.02 | 49.53,31.75 B-C2.2 | B-S.4 77.47,12.7 77.47,11.43 66.04,11.43 66.04,30.48 B-NTE928M2.2
  Bottom 0.305: v52.07,33.02 53.34,34.29 67.31,34.29 | 67.31,34.29 B-NTE928M2.1 | 67.31,34.29 B-NTE928M2.2
N$52
  Top 0.305: B-R7.1 53.34,27.94 50.8,25.4 50.8,22.86 45.72,17.78 44.45,17.78 B-LPF-SW.1
N$53
  Top 0.305: B-R9.1 53.34,31.75 50.8,29.21 50.8,27.94 45.72,22.86 45.72,20.32 B-LPF-SW.2
N$54  (via drill 0.61)
  Top 0.305: v54.61,33.02 54.61,34.29 53.34,35.56 B-R11.1 | v54.61,30.48 48.26,24.13 48.26,22.86
  Top 0.406: B-LPF-SW.3 48.26,22.56 48.26,22.86
  Bottom 0.305: v54.61,30.48 v54.61,33.02
N$55  (via drill 0.61)
  Top 0.305: v57.15,33.02 57.15,40.64 54.61,40.64 53.34,39.37 B-R13.1
  Bottom 0.305: v57.15,33.02 57.15,24.13 53.34,24.13 52.07,22.86 B-LPF-SW.4
N$56
  Top 0.305: B-R8.1 59.69,27.94 58.42,26.67 58.42,16.51 57.15,15.24 B-LPF-SW.7
N$57  (via drill 0.61)
  Top 0.305: v60.96,33.02 59.69,31.75 B-R10.1 | v60.96,26.67 59.69,25.4 59.69,15.24 57.15,12.7 55.88,12.7 B-LPF-SW.8
  Bottom 0.305: v60.96,26.67 v60.96,33.02
N$58  (via drill 0.61)
  Top 0.305: v58.42,31.75 58.42,34.29 59.69,35.56 B-R12.1 | v58.42,29.21 53.34,24.13 53.34,19.05 49.53,15.24 49.53,13.97 53.34,10.16
  Top 0.406: B-LPF-SW.9 53.34,10.46 53.34,10.16
  Bottom 0.305: v58.42,29.21 v58.42,31.75
N$59  (via drill 0.61)
  Top 0.305: v63.5,15.24 63.5,40.64 60.96,40.64 59.69,39.37 B-R14.1
  Bottom 0.305: v63.5,15.24 57.15,8.89 50.8,8.89 49.53,10.16 B-LPF-SW.10
N$60
  Top 0.305: 31.75,11.51 31.75,12.7 29.21,15.24 29.21,16.51 B-R6.2
  Top 0.406: B-SWITCH.1 31.75,11.51 31.75,11.43
N$61  (via drill 0.61)
  Top 0.305: v88.9,40.64 86.36,43.18 P-RN.1
  Bottom 0.305: v88.9,40.64 92.71,44.45 POWER.1
N$62  (via drill 0.61)
  Top 0.305: 49.53,36.83 49.53,39.37 B-C4.2 | 49.53,36.83 49.53,35.56 B-C3.2 | v48.26,36.83 49.53,36.83 | B-NTE928M2.3 69.85,31.75 69.85,34.29 67.31,34.29 64.77,31.75 64.77,10.16 55.88,10.16 53.34,12.7 53.34,13.97 50.8,13.97 B-LPF-SW.C2
  Bottom 0.305: v48.26,36.83 69.85,36.83 71.12,35.56 71.12,31.75 69.85,31.75 B-NTE928M2.3
N$63
  Top 0.305: A-SMA.1 A-R1.1
SMA  (via drill 0.61)
  Top 0.305: 19.05,74.93 16.51,77.47 16.51,78.74 | 21.59,85.09 22.86,85.09 22.86,87.63 21.59,88.9 15.24,88.9 15.24,80.01 16.51,78.74 | 21.59,85.09 20.32,85.09 20.32,86.36 A-C6.1 | 16.51,78.74 A-R2.1 | 17.78,69.85 19.05,71.12 19.05,74.93 | 19.05,74.93 A-R1.2 | 17.78,69.85 24.13,69.85 A-D2.A | A-D1.C 17.78,69.85 | 21.59,85.09 v21.59,80.01
  Bottom 0.305: v21.59,80.01 A-LT1028.2
V+
  Top 0.305: 88.9,55.88 88.9,54.61 86.36,52.07 P-CP.1 | B-LT1358.8 93.98,34.29 93.98,45.72 | 93.98,45.72 POWER.4 | 93.98,55.88 93.98,45.72 | 93.98,55.88 93.98,72.39 A-LT1358.8 85.09,74.93 85.09,71.12 81.28,71.12 81.28,81.28 A-NTE928M1.8 74.93,85.09 74.93,72.39 A-NTE928M2.8 73.66,68.58 73.66,46.99 | 93.98,55.88 88.9,55.88 | 88.9,55.88 P-RP.2 | NTE923D-P.12 NTE923D-P.11 73.66,46.99 | B-NTE928M1.8 74.93,21.59 74.93,34.29 B-NTE928M2.8 73.66,38.1 73.66,46.99
V-  (via drill 0.61)
  Top 0.305: 86.36,45.72 88.9,43.18 | 86.36,45.72 86.36,46.99 | 82.55,25.4 B-LT1358.4 | 82.55,25.4 82.55,41.91 86.36,45.72 | A-LT1358.4 82.55,66.04 82.55,54.61 86.36,50.8 86.36,46.99 | 86.36,46.99 P-CN.1 | 88.9,43.18 v92.71,46.99 | 88.9,43.18 P-RN.2 | v34.29,40.64 34.29,44.45 33.02,45.72 PN-R5.2 | v52.07,39.37 55.88,43.18 | 55.88,43.18 PN-Q1.3 55.88,46.99 | B-NTE928M1.4 67.31,13.97 67.31,26.67 B-NTE928M2.4 71.12,30.48 | A-NTE928M1.4 69.85,77.47 69.85,64.77 A-NTE928M2.4 71.12,60.96 71.12,40.64 | 71.12,40.64 71.12,30.48 | 55.88,43.18 62.23,43.18 64.77,40.64 71.12,40.64 | 82.55,25.4 77.47,20.32 77.47,19.05 71.12,19.05 71.12,30.48
  Bottom 0.305: v92.71,46.99 POWER.2 | v34.29,40.64 35.56,39.37 v52.07,39.37

### Text on the board
tPlace: +10V | A-Ref | +12V | GND | +12V | B-Ref | GND | -10V | -12V | -12V | MIM DC-Amplifier-1.0 | Nov. 20, 2012